# Altium project Baby tracker manilla.PrjPcb
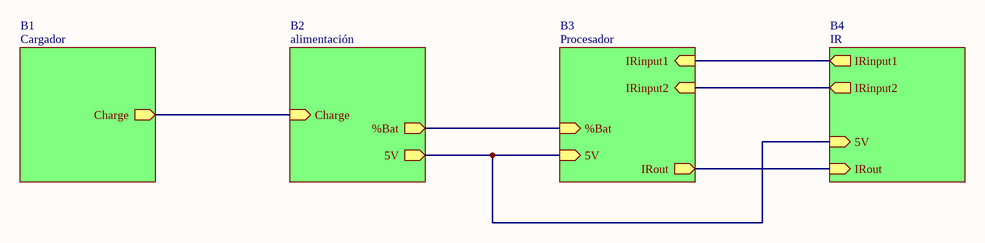
[diagram p0: manilla.SchDoc]
5 sheets, 29 parts. Net scope: hierarchical (ports join the sheet entries above them; power ports are global).
Board file: PCB_Manilla.PcbDoc
Sheets:
  manilla.SchDoc
    B2 = alimentación.SchDoc
    B3 = Procesador.SchDoc
    B4 = IR.SchDoc
    B1 = Cargador.SchDoc

## Sheet manilla.SchDoc
size A4; SheetNumber: 1; SheetTotal: 5

### Sub-sheets
B1 = Cargador: Charge (out)
B2 = alimentación: 5V (out), %Bat (out), Charge (in)
B3 = Procesador: %Bat (in), 5V (in), IRout (out), IRinput1 (in), IRinput2 (in)
B4 = IR: 5V (in), IRout (in), IRinput1 (out), IRinput2 (out)

### Nets
NetC5_1: sheet B2/5V, sheet B3/5V, sheet B4/5V
NetP1_1: sheet B2/Charge, sheet B1/Charge
NetP3_1: sheet B2/%Bat, sheet B3/%Bat
NetP4_2: sheet B3/IRinput2, sheet B4/IRinput2
NetP5_2: sheet B3/IRinput1, sheet B4/IRinput1
NetP6_1: sheet B3/IRout, sheet B4/IRout

## Sheet alimentación.SchDoc
size A4; SheetNumber: 3; SheetTotal: 5; SPICEModelCacheNBWNHLZJ: <root> / <DocumentId>NBWNHLZJ</DocumentId> / <CacheFrame Number="0"> / <Model Name="pnp" Kind="MDL"> / <Text>*Default PNP BJT / *PNP Trans Pinout: C,B,E / .MODEL PNP PNP()</Text> / </Model> / </CacheFrame> / </root>
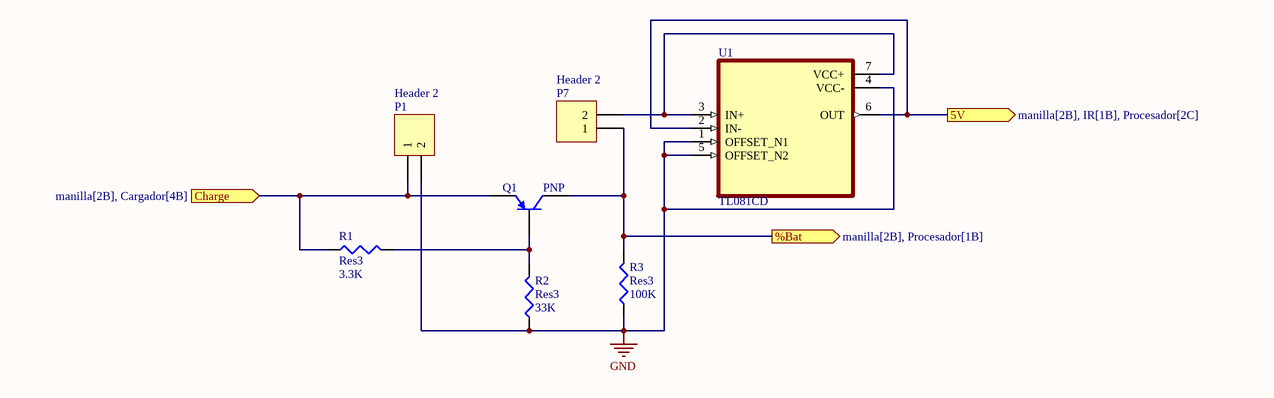
[diagram p1: alimentación.SchDoc]

### Parts
P1  Header 2  [HDR1X2]
P7  Header 2  [HDR1X2]
Q1  PNP  [SOT-23B_M]
R1  Res3  value 3.3K  [J1-0603]
R2  Res3  value 33K  [J1-0603]
R3  Res3  value 100K  [J1-0603]
U1  TL081CD  [SOIC127P599X175-8N]

### Ports
5V (out, see manilla[2B], IR[1B], Procesador[2C]), %Bat (out, see manilla[2B], Procesador[1B]), Charge (in, see manilla[2B], Cargador[4B])

### Nets
GND: P1.2 R2.1 R3.1 U1.1(OFFSET_N1) U1.4(VCC-) U1.5(OFFSET_N2)
NetC5_1: U1.2(IN-) U1.6(OUT) ; port 5V
NetP1_1: P1.1 Q1.3(E) R1.1 ; port Charge
NetP3_1: P7.1 Q1.1(C) R3.2 ; port %Bat
NetP7_2: P7.2 U1.3(IN+) U1.7(VCC+)
NetQ1_2: Q1.2(B) R1.2 R2.2

### Library data of the parts
P1 P7 = Header 2: Header, 2-Pin; LatestRevisionDate: 17-Jul-2002; LatestRevisionNote: Re-released for DXP Platform.; Publisher: Altium Limited
Q1 = PNP: PNP Bipolar Transistor; Published: 8-Jun-2000; LatestRevisionDate: 29-May-2009; LatestRevisionNote: IPC-7351 Footprint Added.; PackageVersion: Aug-1999; PackageReference: SOT-23B; Publisher: Altium Limited; PackageDescription: 3-Pin SOT-23 Package 0.95 mm Pitch, 2.4 mm Lead Span
R1-R3 = Res3: Resistor; Published: 8-Jun-2000; LatestRevisionDate: 29-May-2009; LatestRevisionNote: IPC-7351 Footprint Added.; PackageReference: J1-0603; Publisher: Altium Limited; PackageDescription: Chip Resistor
U1 = TL081CD: High Slew Rate JFET-Input Operational Amplifier 8-SOIC 0 to 70; MF: Texas Instruments; Package: SOIC-8 Texas Instruments; SnapEDA_Link: https://www.snapeda.com/parts/TL081CD/Texas%20Instruments/view-part/4793911/?ref=snap; MP: TL081CD; Availability: Good; Price: None; Value: *; Purchase-URL: https://pricing.snapeda.com/search/part/TL081CD/?ref=eda

## Sheet Procesador.SchDoc
size A4; SheetNumber: 5; SheetTotal: 5; SPICEModelCacheQBTRCJJJ: <root> / <DocumentId>QBTRCJJJ</DocumentId> / </root>
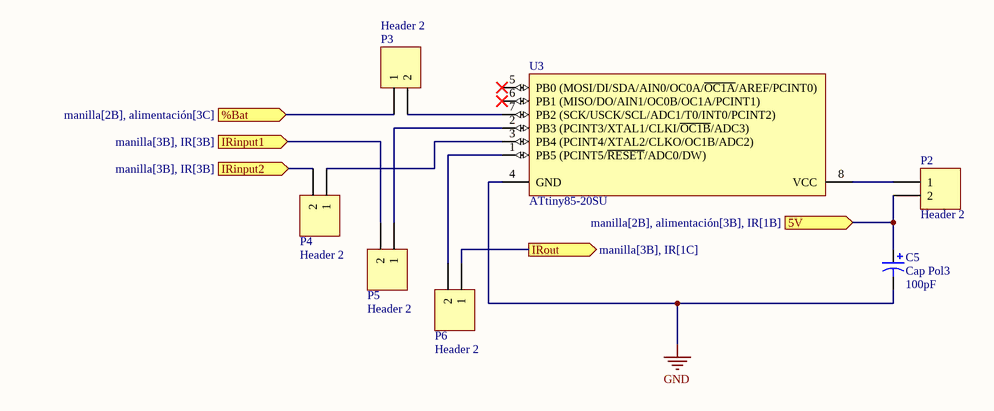
[diagram p2: Procesador.SchDoc]

### Parts
C5  Cap Pol3  value 100pF  [C0805]
P2  Header 2  [HDR1X2]
P3  Header 2  [HDR1X2]
P4  Header 2  [HDR1X2]
P5  Header 2  [HDR1X2]
P6  Header 2  [HDR1X2]
U3  ATtiny85-20SU  [8S2_M]

### Ports
5V (in, see manilla[2B], alimentación[3B], IR[1B]), %Bat (in, see manilla[2B], alimentación[3C]), IRinput1 (in, see manilla[3B], IR[3B]), IRinput2 (in, see manilla[3B], IR[3B]), IRout (out, see manilla[3B], IR[1C])

### Nets
GND: C5.2 U3.4(GND)
NetC5_1: C5.1 P2.2 ; port 5V
NetP2_1: P2.1 U3.8(VCC)
NetP3_1: P3.1 ; port %Bat
NetP3_2: P3.2 U3.7(PB2_(SCK/USCK/SCL/ADC1/T0/INT0/PCINT2))
NetP4_1: P4.1 U3.3(PB4_(PCINT4/XTAL2/CLKO/OC1B/ADC2))
NetP4_2: P4.2 ; port IRinput2
NetP5_1: P5.1 U3.2(PB3_(PCINT3/XTAL1/CLKI/~{OC1B}/ADC3))
NetP5_2: P5.2 ; port IRinput1
NetP6_1: P6.1 ; port IRout
NetP6_2: P6.2 U3.1(PB5_(PCINT5/~{RESET}/ADC0/DW))

Not connected (* = marked no-connect by the designer): U3 5(PB0_(MOSI/DI/SDA/AIN0/OC0A/~{OC1A}/AREF/PCINT0))* 6(PB1_(MISO/DO/AIN1/OC0B/OC1A/PCINT1))*

### Library data of the parts
C5 = Cap Pol3: Polarized Capacitor (Surface Mount); Published: 8-Jun-2000; LatestRevisionDate: 29-May-2009; LatestRevisionNote: IPC-7351 Footprint Added.; PackageReference: C0805; Publisher: Altium Limited; PackageDescription: Chip Capacitor
P2-P6 = Header 2: Header, 2-Pin; LatestRevisionDate: 17-Jul-2002; LatestRevisionNote: Re-released for DXP Platform.; Publisher: Altium Limited
U3 = CMP-0093-00173-2: 8-bit AVR Microcontroller, 20MHz, 2.7-5.5V, 8K Flash, 512 Bytes EEPROM, 512 Bytes SRAM, Industrial Grade (-40°C to 85°C), 8-Lead SOIC, Pb-Free; ComponentLink3Description: ATtiny25/45/85 Summary; DatasheetVersion: revN, Apr-2011; PackageVersion: revF, Apr-2008; ComponentLink3URL: http://www.atmel.com/dyn/resources/prod_documents/2586S.pdf; ComponentLink1URL: http://www.atmel.com/; ComponentLink2Description: ATtiny25/45/85 Datasheet; RevisionNote: DatasheetVersion updated. URLs added.; PackageDescription: 8-Lead, 0.208" Body, Plastic Small Outline Package (EIAJ); ComponentLink1Description: Manufacturer URL; PackageReference: 8S2; ComponentLink2URL: http://www.atmel.com/dyn/resources/prod_documents/doc2586.pdf

## Sheet IR.SchDoc
size A4; SheetNumber: 2; SheetTotal: 5; SPICEModelCacheFKEPQCTG: <root> / <DocumentId>FKEPQCTG</DocumentId> / </root>
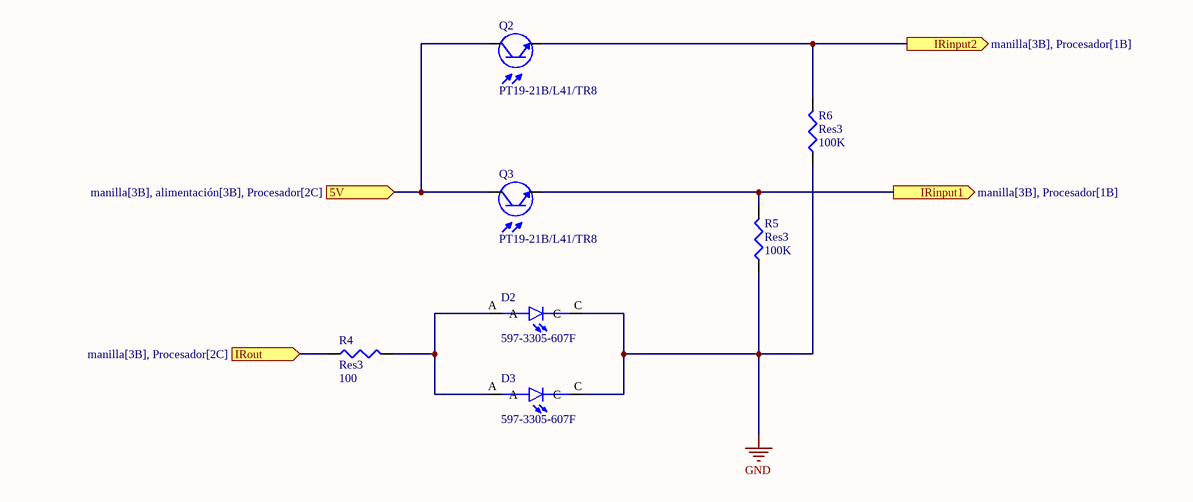
[diagram p3: IR.SchDoc]

### Parts
D2  597-3305-607F  [LEDC2012X70N]
D3  597-3305-607F  [LEDC2012X70N]
Q2  PT19-21B/L41/TR8  [XDCR_PT19-21B/L41/TR8]
Q3  PT19-21B/L41/TR8  [XDCR_PT19-21B/L41/TR8]
R4  Res3  value 100  [J1-0603]
R5  Res3  value 100K  [J1-0603]
R6  Res3  value 100K  [J1-0603]

### Ports
5V (in, see manilla[3B], alimentación[3B], Procesador[2C]), IRinput1 (out, see manilla[3B], Procesador[1B]), IRinput2 (out, see manilla[3B], Procesador[1B]), IRout (in, see manilla[3B], Procesador[2C])

### Nets
GND: D2.C D3.C R5.1 R6.1
NetC5_1: Q2.C Q3.C ; port 5V
NetD2_A: D2.A D3.A R4.2
NetP4_2: Q2.E R6.2 ; port IRinput2
NetP5_2: Q3.E R5.2 ; port IRinput1
NetP6_1: R4.1 ; port IRout

### Library data of the parts
D2 D3 = 597-3305-607F: LED Uni-Color Green 4-Pin Chip 0805 T/R; Availability: Unavailable; Value: *; Price: None; MP: 597-3305-607F; Package: None
Q2 Q3 = PT19-21B/L41/TR8: Phototransistors 940nm Top View 0603 (1608 Metric); Package: None; Price: None; Value: *; MP: PT19-21B/L41/TR8; Availability: Unavailable
R4-R6 = Res3: Resistor; Published: 8-Jun-2000; LatestRevisionDate: 29-May-2009; LatestRevisionNote: IPC-7351 Footprint Added.; PackageReference: J1-0603; Publisher: Altium Limited; PackageDescription: Chip Resistor

## Sheet Cargador.SchDoc
size A4; SheetNumber: 4; SheetTotal: 5; SPICEModelCacheMPYIFOMC: <root> / <DocumentId>MPYIFOMC</DocumentId> / </root>
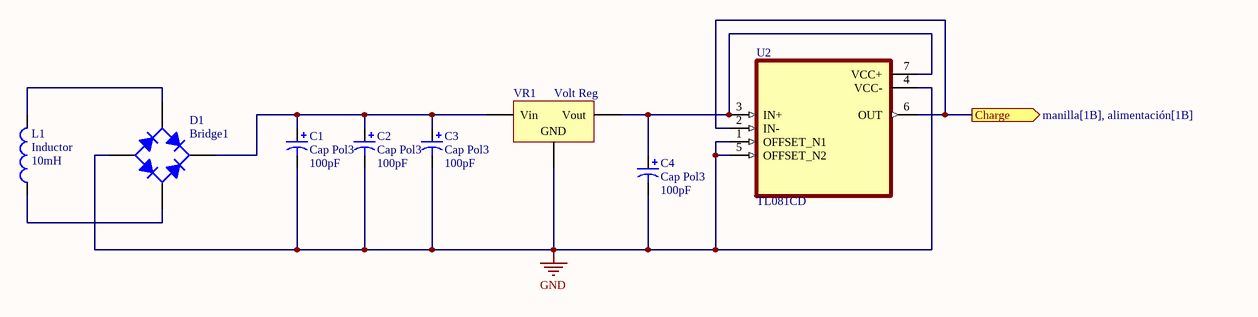
[diagram p4: Cargador.SchDoc]

### Parts
C1  Cap Pol3  value 100pF  [C0805]
C2  Cap Pol3  value 100pF  [C0805]
C3  Cap Pol3  value 100pF  [C0805]
C4  Cap Pol3  value 100pF  [C0805]
D1  Bridge1  [D-38]
L1  Inductor  value 10mH  [0402-A]
U2  TL081CD  [SOIC127P599X175-8N]
VR1  Volt Reg  [D2PAK_M]

### Ports
Charge (out, see manilla[1B], alimentación[1B])

### Nets
GND: C1.2 C2.2 C3.2 C4.2 D1.3(A) U2.1(OFFSET_N1) U2.4(VCC-) U2.5(OFFSET_N2) VR1.2(GND)
NetC1_1: C1.1 C2.1 C3.1 D1.1(K) VR1.1(Vin)
NetC4_1: C4.1 U2.3(IN+) U2.7(VCC+) VR1.3(Vout)
NetD1_2: D1.2(C) L1.1
NetD1_4: D1.4(C) L1.2
NetP1_1: U2.2(IN-) U2.6(OUT) ; port Charge

### Library data of the parts
C1-C4 = Cap Pol3: Polarized Capacitor (Surface Mount); Published: 8-Jun-2000; LatestRevisionDate: 29-May-2009; LatestRevisionNote: IPC-7351 Footprint Added.; PackageReference: C0805; Publisher: Altium Limited; PackageDescription: Chip Capacitor
D1 = Bridge1: Full Wave Diode Bridge; Published: 8-Jun-2000; LatestRevisionDate: 29-May-2009; LatestRevisionNote: Sch pins A & K swapped.; DatasheetVersion: E2732B; PackageReference: D-38; Publisher: Altium Limited; PackageDescription: Bridge Rectifier; 4 Terminals; Body 9.4 x 9.4 mm (typ); Pitch 5.08 mm
L1 = Inductor: Code_IEC: 1005; Published: 8-Jun-2000; LatestRevisionDate: 29-May-2009; LatestRevisionNote: IPC-7351 Footprint Added.; PackageReference: 0402-A; Publisher: Altium Limited; PackageDescription: Chip Inductor; Code_JEITA: 0402
U2 = TL081CD: as U1 on sheet alimentación; Package: SOIC-8 Texas Instruments; SnapEDA_Link: https://www.snapeda.com/parts/TL081CD/Texas%20Instruments/view-part/4793911/?ref=snap; MP: TL081CD; Availability: Good; Price: None; Value: *; Purchase-URL: https://pricing.snapeda.com/search/part/TL081CD/?ref=eda
VR1 = Volt Reg: Voltage Regulator; Published: 24-Mar-1999; LatestRevisionDate: 29-May-2009; LatestRevisionNote: IPC-7351 Footprint Added.; PackageReference: D2PAK; Publisher: Altium Limited; PackageDescription: 3-Pin Transistor Outline Package 2.54 mm Pitch, 15.1 mm Lead Span

## Nets that join several sheets
GND: alimentación (6 pins), Procesador (C5.2 U3.4), IR (D2.C D3.C R5.1 R6.1), Cargador (9 pins)
NetC5_1: alimentación (U1.2 U1.6), Procesador (C5.1 P2.2), IR (Q2.C Q3.C)
NetP1_1: alimentación (P1.1 Q1.3 R1.1), Cargador (U2.2 U2.6)
NetP3_1: alimentación (P7.1 Q1.1 R3.2), Procesador (P3.1)
NetP4_2: Procesador (P4.2), IR (Q2.E R6.2)
NetP5_2: Procesador (P5.2), IR (Q3.E R5.2)
NetP6_1: Procesador (P6.1), IR (R4.1)